# Altium schematic sheet Ethernet.SchDoc
size 420 x 297 mm; Address1: Address1; Address2: Address2; Address3: Address3; Address4: Address4; DocumentNumber: Э3; SheetNumber: 2; SheetTotal: 5; Scale: 1:1; DocumentType: Схема электрическая принципиальная; FirstReferrence: АБВГ.123456.001
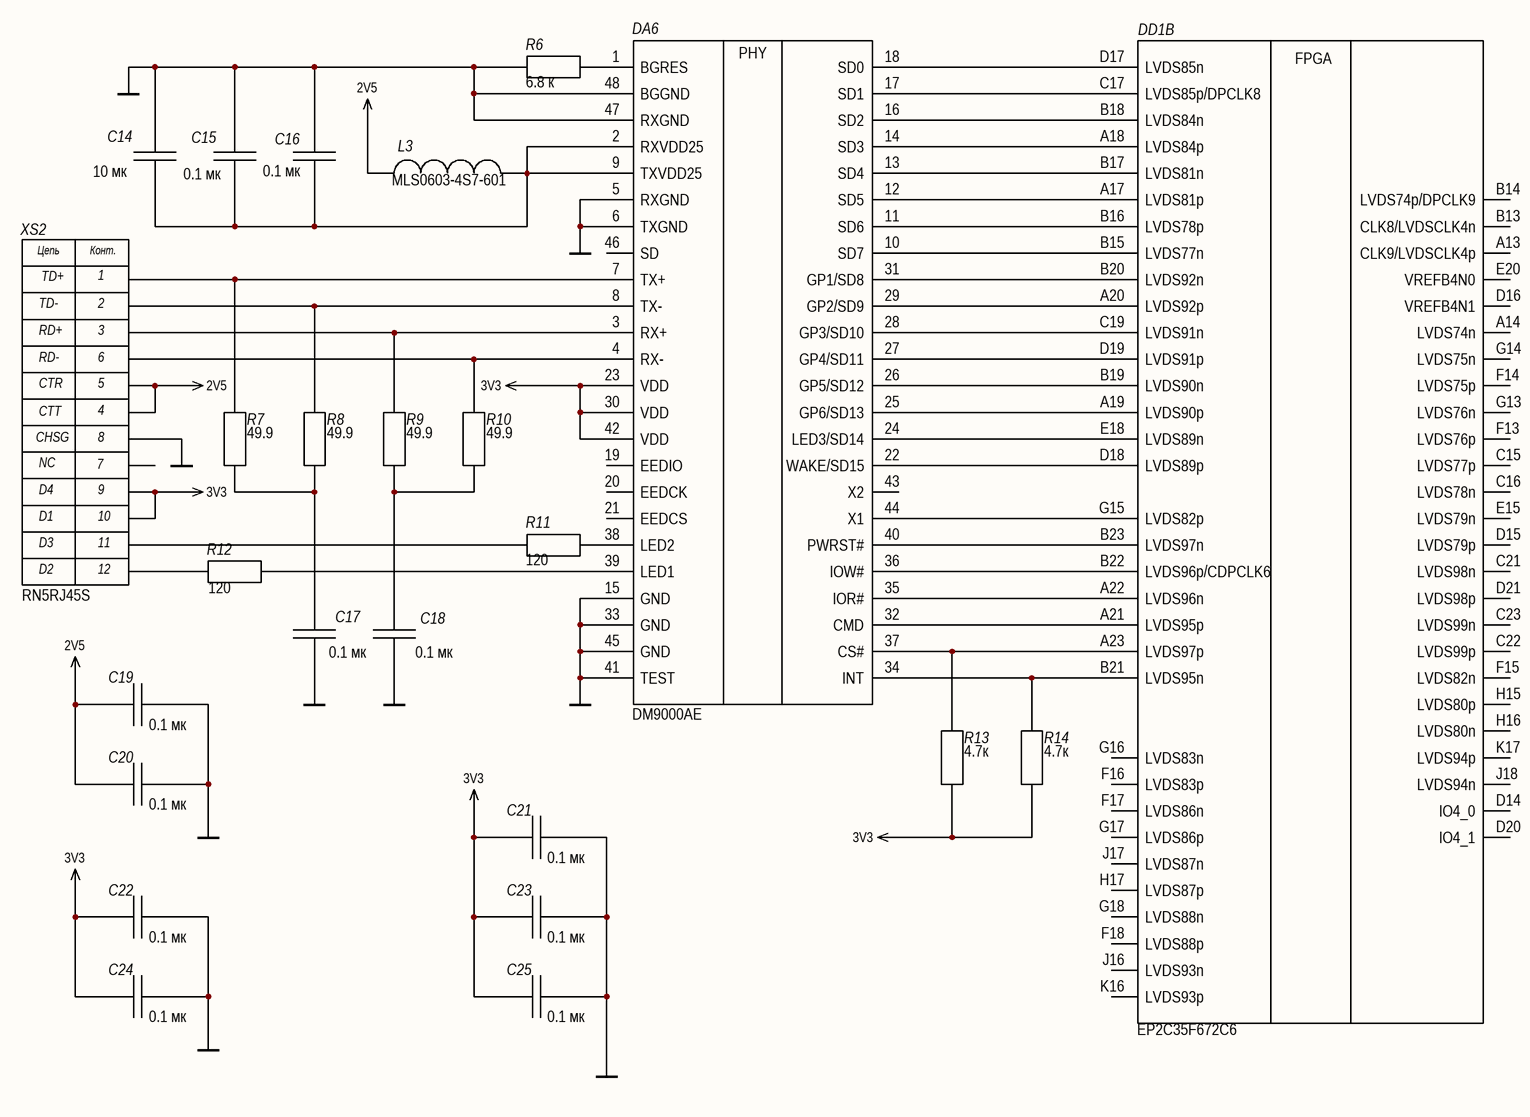
[diagram p0: Ethernet.SchDoc]

## Parts
C14  (no value)
C15  (no value)
C16  (no value)
C17  (no value)
C18  (no value)
C19  (no value)
C20  (no value)
C21  (no value)
C22  (no value)
C23  (no value)
C24  (no value)
C25  (no value)
DA6  DM9000AE
DD1  EP2C35F672C6  (part B of 7)
L3  L  (value not drawn)
R6  6.8 к
R7  49.9
R8  49.9
R9  49.9
R10  49.9
R11  120
R12  120
R13  4.7к
R14  4.7к
XS2  RN5RJ45S

## Nets
2V5: C19.2 C20.2 L3.1 XS2.4 XS2.5
3V3: C21.2 C22.2 C23.2 C24.2 C25.2 DA6.23(VDD) DA6.30(VDD) DA6.42(VDD) R13.1 R14.1 XS2.9 XS2.10
GND: C14.2 C15.2 C16.2 C17.1 C18.1 C19.1 C20.1 C21.1 C22.1 C23.1 C24.1 C25.1 DA6.5(RXGND) DA6.6(TXGND) DA6.15(GND) DA6.33(GND) DA6.41(TEST) DA6.45(GND) DA6.47(RXGND) DA6.48(BGGND) R6.1 XS2.8
NetC14_1: C14.1 C15.1 C16.1 DA6.2(RXVDD25) DA6.9(TXVDD25) L3.2
NetC17_2: C17.2 R7.1 R8.1
NetC18_2: C18.2 R9.1 R10.1
NetDA6_1: DA6.1(BGRES) R6.2
NetDA6_3: DA6.3(RX+) R9.2 XS2.3
NetDA6_4: DA6.4(RX-) R10.2 XS2.6
NetDA6_7: DA6.7(TX+) R7.2 XS2.1
NetDA6_8: DA6.8(TX-) R8.2 XS2.2
NetDA6_10: DA6.10(SD7) DD1.B15(LVDS77n)
NetDA6_11: DA6.11(SD6) DD1.B16(LVDS78p)
NetDA6_12: DA6.12(SD5) DD1.A17(LVDS81p)
NetDA6_13: DA6.13(SD4) DD1.B17(LVDS81n)
NetDA6_14: DA6.14(SD3) DD1.A18(LVDS84p)
NetDA6_16: DA6.16(SD2) DD1.B18(LVDS84n)
NetDA6_17: DA6.17(SD1) DD1.C17(LVDS85p/DPCLK8)
NetDA6_18: DA6.18(SD0) DD1.D17(LVDS85n)
NetDA6_22: DA6.22(WAKE/SD15) DD1.D18(LVDS89p)
NetDA6_24: DA6.24(LED3/SD14) DD1.E18(LVDS89n)
NetDA6_25: DA6.25(GP6/SD13) DD1.A19(LVDS90p)
NetDA6_26: DA6.26(GP5/SD12) DD1.B19(LVDS90n)
NetDA6_27: DA6.27(GP4/SD11) DD1.D19(LVDS91p)
NetDA6_28: DA6.28(GP3/SD10) DD1.C19(LVDS91n)
NetDA6_29: DA6.29(GP2/SD9) DD1.A20(LVDS92p)
NetDA6_31: DA6.31(GP1/SD8) DD1.B20(LVDS92n)
NetDA6_32: DA6.32(CMD) DD1.A21(LVDS95p)
NetDA6_34: DA6.34(INT) DD1.B21(LVDS95n) R14.2
NetDA6_35: DA6.35(IOR#) DD1.A22(LVDS96n)
NetDA6_36: DA6.36(IOW#) DD1.B22(LVDS96p/CDPCLK6)
NetDA6_37: DA6.37(CS#) DD1.A23(LVDS97p) R13.2
NetDA6_38: DA6.38(LED2) R11.2
NetDA6_39: DA6.39(LED1) R12.2
NetDA6_40: DA6.40(PWRST#) DD1.B23(LVDS97n)
NetDA6_44: DA6.44(X1) DD1.G15(LVDS82p)
NetR11_1: R11.1 XS2.11
NetR12_1: R12.1 XS2.12

Not connected (* = marked no-connect by the designer): DA6 19(EEDIO) 20(EEDCK) 21(EEDCS) 43(X2) 46(SD); DD1 A13(CLK9/LVDSCLK4p) A14(LVDS74n) B13(CLK8/LVDSCLK4n) B14(LVDS74p/DPCLK9) C15(LVDS77p) C16(LVDS78n) C21(LVDS98n) C22(LVDS99p) C23(LVDS99n) D14(IO4_0) D15(LVDS79p) D16(VREFB4N1) D20(IO4_1) D21(LVDS98p) E15(LVDS79n) E20(VREFB4N0) F13(LVDS76p) F14(LVDS75p) F15(LVDS82n) F16(LVDS83p) F17(LVDS86n) F18(LVDS88p) G13(LVDS76n) G14(LVDS75n) G16(LVDS83n) G17(LVDS86p) G18(LVDS88n) H15(LVDS80p) H16(LVDS80n) H17(LVDS87p) J16(LVDS93n) J17(LVDS87n) J18(LVDS94n) K16(LVDS93p) K17(LVDS94p); XS2 7

## Notes on the sheet
- (near C14) 10 мк
- (near C15) 0.1 мк
- (near C16) 0.1 мк
- (near L3) MLS0603-4S7-601
- 0.1 мк
- (near C18) 0.1 мк
- (near C19) 0.1 мк
- (near C20) 0.1 мк
- (near C21) 0.1 мк
- (near C22) 0.1 мк
- (near C23) 0.1 мк
- (near C24) 0.1 мк
- (near C25) 0.1 мк
- Подп. и дата
- Инв. № дубл.
- Взам. инв. №
- Инв. № подл.
- Изм.
- Лист
- № докум.
- Подп.
- Дата
- 2.106-A3
- Копировал
- Формат А3
- (in symbol DM9000AE) PHY
- (in symbol Ethernet_RJ45) Цепь; Конт.; TD+; TD-; RD+; RD-; CTR; CTT; CHSG; NC; D4; D1; D3; D2
- (in symbol PLIS, part B) FPGA

## Library data of the parts
C14-C25 = C: ValueType: Конденсатор
DD1 = PLIS
R6-R14 = R
XS2 = Ethernet_RJ45